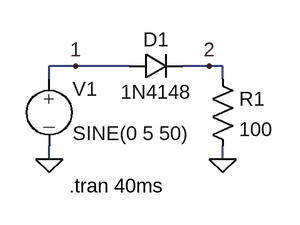
[diagram p0: schematic gleichrichter_einweg.asc]
gleichrichter_einweg.asc, the LTspice schematic file:
Version 4
SHEET 1 880 680
WIRE 96 112 64 112
WIRE 160 112 96 112
WIRE 256 112 224 112
WIRE 272 112 256 112
WIRE 64 128 64 112
WIRE 272 128 272 112
WIRE 64 224 64 208
WIRE 272 224 272 208
FLAG 272 224 0
FLAG 64 224 0
FLAG 256 112 2
FLAG 96 112 1
SYMBOL diode 160 128 R270
WINDOW 0 32 32 VTop 2
WINDOW 3 0 32 VBottom 2
SYMATTR InstName D1
SYMATTR Value 1N4148
SYMBOL res 256 112 R0
SYMATTR InstName R1
SYMATTR Value 100
SYMBOL source-V 64 112 R0
WINDOW 123 0 0 Left 2
WINDOW 39 0 0 Left 2
SYMATTR InstName V1
SYMATTR Value SINE(0 5 50)
TEXT 88 256 Left 2 !.tran 40ms

The netlist it stands for:
* gleichrichter_einweg.asc
D1 1 2 1N4148
R1 2 0 100
V1 1 0 SINE(0 5 50)
.model D D
.lib standard.dio
.tran 40ms
.backanno
.end